# EAGLE schematic BBiQ-Teensy (EAGLE 9.1.0)
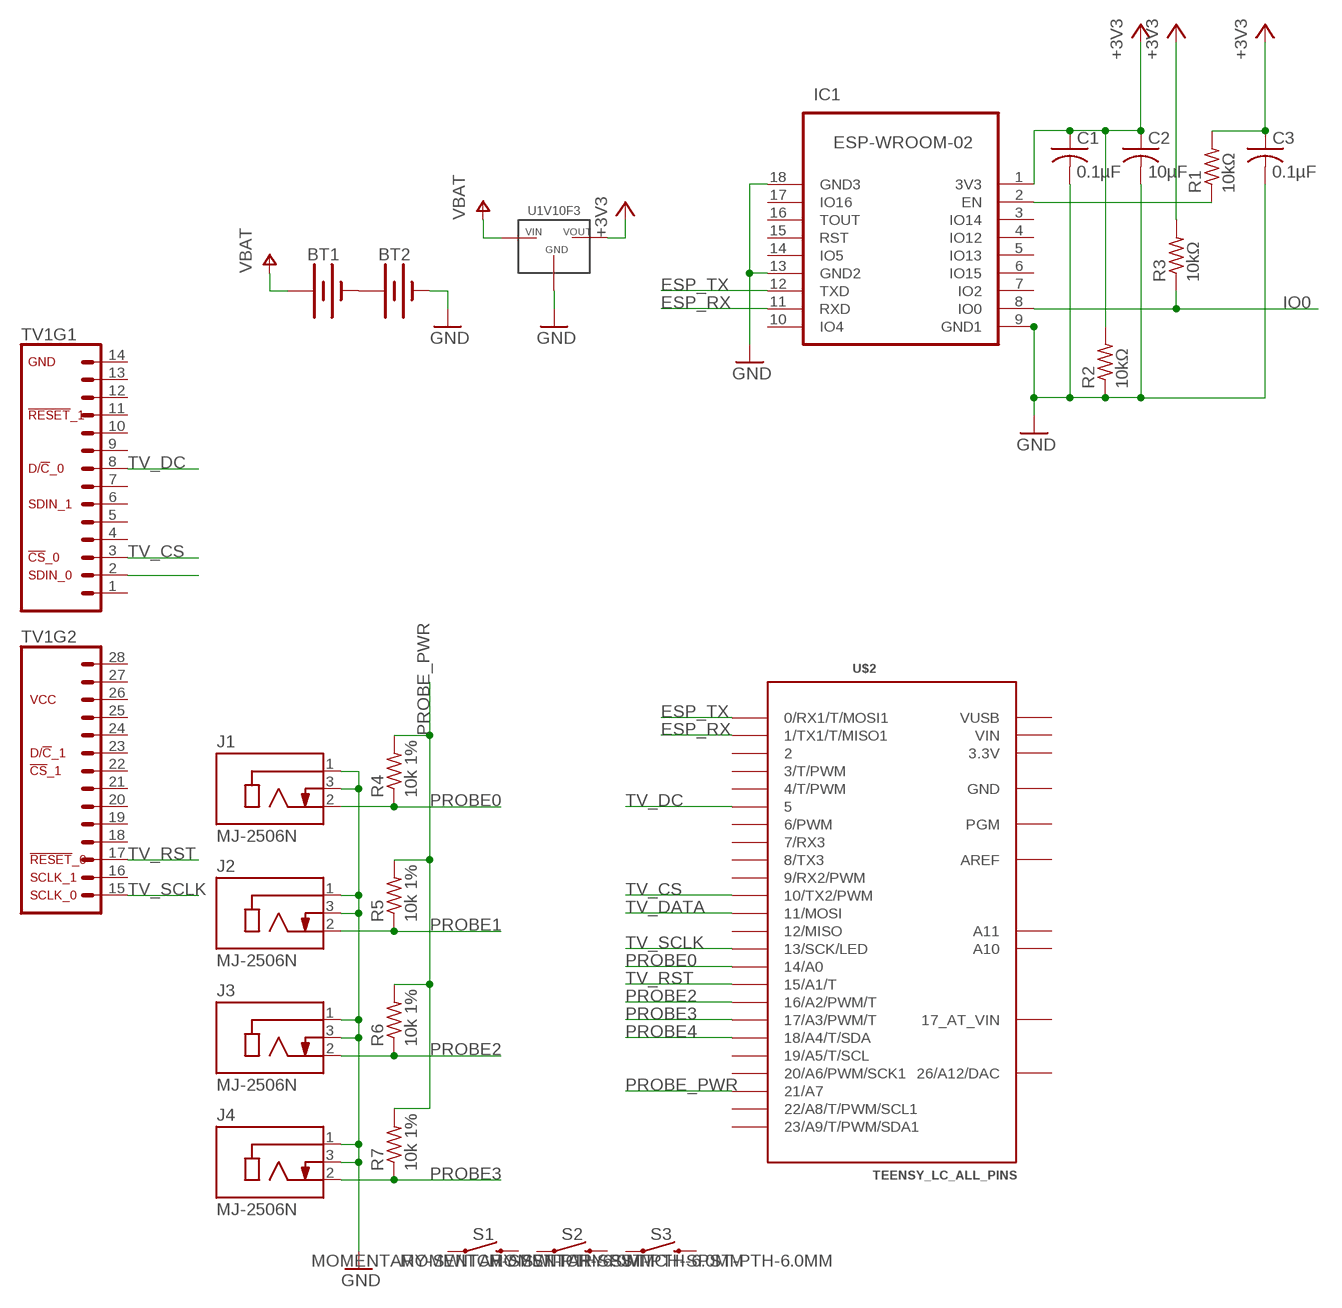
[diagram p0: schematic, sheet 1]

## Parts
BT1  BATTERY-AA  [BATTERY-AA]
BT2  BATTERY-AA  [BATTERY-AA]
C1  0.1µF  C-US025-025X050  [C025-025X050]
C2  10µF  C-US025-025X050  [C025-025X050]
C3  0.1µF  C-US025-025X050  [C025-025X050]
IC1  ESP-WROOM-02  [ESP-WROOM-02]
J1  MJ-2506N  [CUI_MJ-2506N]
J2  MJ-2506N  [CUI_MJ-2506N]
J3  MJ-2506N  [CUI_MJ-2506N]
J4  MJ-2506N  [CUI_MJ-2506N]
R1  10kΩ  R-US_0204/5  [0204/5]
R2  10kΩ  R-US_0204/5  [0204/5]
R3  10kΩ  R-US_0204/5  [0204/5]
R4  10k 1%  R-US_0204/5  [0204/5]
R5  10k 1%  R-US_0204/5  [0204/5]
R6  10k 1%  R-US_0204/5  [0204/5]
R7  10k 1%  R-US_0204/5  [0204/5]
S1  MOMENTARY-SWITCH-SPST-PTH-6.0MM  [TACTILE_SWITCH_PTH_6.0MM]
S2  MOMENTARY-SWITCH-SPST-PTH-6.0MM  [TACTILE_SWITCH_PTH_6.0MM]
S3  MOMENTARY-SWITCH-SPST-PTH-6.0MM  [TACTILE_SWITCH_PTH_6.0MM]
TV1  TEENSYVIEW  [TEENSYVIEW]
U$1  U1V10F3  [U1V10F3]
U$2  TEENSY_LC_ALL_PINS  [TEENSY_3.0-3.2&LC_ALL_PINS]

## Nets
+3V3: C1.1 C2.1 C3.1 IC1.1(3V3) R1.2 R2.2 R3.2 U$1.VOUT
ESP_RX: IC1.11(RXD) U$2.1(1/TX1/T/MISO1)
ESP_TX: IC1.12(TXD) U$2.0(0/RX1/T/MOSI1)
GND: BT2.GND@1(-) C1.2 C2.2 C3.2 IC1.9(GND1) IC1.13(GND2) IC1.18(GND3) IC1.19(GND0) J1.1 J1.3 J2.1 J2.3 J3.1 J3.3 J4.1 J4.3 R2.1 U$1.GND
IO0: IC1.8(IO0) R3.1
N$1: BT1.GND@1(-) BT2.PWR@1(+)
N$3: IC1.2(EN) R1.1
PROBE0: J1.2 R4.1 U$2.14/A0
PROBE1: J2.2 R5.1
PROBE2: J3.2 R6.1 U$2.16/A2(16/A2/PWM/T)
PROBE3: J4.2 R7.1 U$2.17/A3(17/A3/PWM/T)
PROBE4: U$2.18/A4(18/A4/T/SDA)
PROBE_PWR: R4.2 R5.2 R6.2 R7.2 U$2.21/A7
TV_CS: TV1.3 U$2.10(10/TX2/PWM)
TV_DATA: TV1.2 U$2.11(11/MOSI)
TV_DC: TV1.8 U$2.5
TV_RST: TV1.17 U$2.15/A1(15/A1/T)
TV_SCLK: TV1.15 U$2.13(13/SCK/LED)
V+: BT1.PWR@1(+) U$1.VIN ; supply symbol labelled VBAT
Unconnected: IC1.3(IO14) IC1.4(IO12) IC1.5(IO13) IC1.6(IO15) IC1.7(IO2) IC1.10(IO4) IC1.14(IO5) IC1.15(RST) IC1.16(TOUT) IC1.17(IO16) S1.1 S1.3 S2.1 S2.3 S3.1 S3.3 TV1.1 TV1.4 TV1.5 TV1.6 TV1.7 TV1.9 TV1.10 TV1.11 TV1.12 TV1.13 TV1.14 TV1.16 TV1.18 TV1.19 TV1.20 TV1.21 TV1.22 TV1.23 TV1.24 TV1.25 TV1.26 TV1.27 TV1.28 U$2.2 U$2.3(3/T/PWM) U$2.4(4/T/PWM) U$2.6(6/PWM) U$2.7(7/RX3) U$2.8(8/TX3) U$2.9(9/RX2/PWM) U$2.12(12/MISO) U$2.19/A5(19/A5/T/SCL) U$2.20/A6(20/A6/PWM/SCK1) U$2.22/A8(22/A8/T/PWM/SCL1) U$2.23/A9(23/A9/T/PWM/SDA1) U$2.A10 U$2.A11 U$2.PGM U$2.VBAT(17_AT_VIN)

## Power pins joined to a net without a drawn wire
26/A12/DAC: U$2.RESET/DAC(26/A12/DAC)
+3V3: U$2.3.3V U$2.3.3V1(3.3V)
AREF: U$2.AREF
GND: U$2.AGND(GND) U$2.GND U$2.GND1(GND)
VIN: U$2.VIN
VUSB: U$2.VUSB

## Library data of the parts
BT1 BT2 = SparkFun-Batteries:BATTERY: Battery - Single Cell A variety of battery chemistries, sizes, and footprints. Device List: 20MM_PTH - Coin Cell Battery Holder - 20mm (PTH) <https://www.sparkfun.com/products/783> 6.8MM_PTH - Coin Cell Battery Holder - 6.8MM(SMD) <https://www.digikey.com/product-detail/en/seiko-instruments/MS621FE-FL11E/728-1057-ND/1889208?WT.srch=1&gclid=CNOQ5a6LzdQCFZS2wAodXCkE0g> 12MM_SMD - Coin Cell Battery Holder - 12mm (SMD) <https://www.sparkfun.com/products/10592> 12MM_PTH - Coin Cell Battery Holder - 12mm (PTH) <https://www.sparkfun.com/products/7948> 20MM_SMD - 20mm Coin Cell Battery Holder (SMD) (2 legs) Used on the Big Time Watch Kit <https://www.sparkfun.com/products/11734> 20MM_SMD_4LEGS - Coin Cell Battery Holder - 20mm (SMD) <https://www.sparkfun.com/products/11892> 20MM_SMD_4LEGS_OVERPASTE - Coin Cell Battery Holder - 20mm (SMD) <https://www.sparkfun.com/products/11892> (Over-paste on the legs) 24.5MM_PTH - Coin Cell Battery Holder - 24.5mm (PTH) <https://www.sparkfun.com/products/8863> 9V - 9V Battery Holder - PC Mount Used on the SparkFun SparkPunk Sound Kit <https://www.sparkfun.com/products/11177> and SparkFun SparkPunk Sequencer Kit <https://www.sparkfun.com/products/12707> 18650 - Battery Holder - 18650 (PTH) <https://www.sparkfun.com/products/13113> AA - Battery Holder - 1xAA (PTH) <https://www.sparkfun.com/products/7949> AAA - Battery Holder - 1xAAA (PTH) <https://www.sparkfun.com/products/12718> AA_KIT - Battery Holder - 1xAA (PTH) <https://www.sparkfun.com/products/7949> Special kit package - pads only have exposed copper on one side of the board. AAA_KIT - Battery Holder - 1xAAA (PTH) <https://www.sparkfun.com/products/12718> Special kit package - pads only have exposed copper on one side of the board.; PROD_ID: BATT-08316; SF_SKU: PRT-07949
C1-C3 = resistor:C-US: CAPACITOR, American symbol
IC1 = esp-wroom-02:ESP-WROOM-02: WiFi module - ESP-WROOM-02
J1-J4 = MJ-2506N:MJ-2506N: 2.5 mm, Mono, Right Angle, Through Hole, Audio Jack Connector; MANUFACTURER: CUI INC; PART_REV: E; STANDARD: MANUFACTURER RECOMMENDATIONS
R1-R7 = resistor:R-US_: RESISTOR, American symbol
S1-S3 = SparkFun-Switches:MOMENTARY-SWITCH-SPST: Momentary Switch (Pushbutton) - SPST Normally-open (NO) SPST momentary switches (buttons, pushbuttons). Variants PTH-12MM - 12mm square, through-hole Momentary Pushbutton Switch - 12mm Square <https://www.sparkfun.com/products/9190> (COM-09190) PTH-6.0MM, PTH-6.0MM-KIT - 6.0mm square, through-hole Mini Pushbutton Switch <https://www.sparkfun.com/products/97> (COM-00097) KIT package intended for soldering kit's - only one side of pads' copper is exposed. PTH-RIGHT-ANGLE-KIT - Right-angle, through-hole Right Angle Tactile Button <https://www.sparkfun.com/products/10791> - Used on SparkFun BigTime Watch Kit <https://www.sparkfun.com/products/11734> SMD-12MM - 12mm square, surface-mount Tactile Button - SMD (12mm) <https://www.sparkfun.com/products/12993> (COM-12993) Used on SparkFun PicoBoard <https://www.sparkfun.com/products/11888> SMD-4.5MM - 4.5mm Square Trackball Switch Used on SparkFun Blackberry Trackballer Breakout <https://www.sparkfun.com/products/13169> SMD-4.6MMX2.8MM - 4.60mm x 2.80mm, surface mount Used on SparkFun SAMD21 Mini Breakout <https://www.sparkfun.com/products/13664> SMD-5.2MM, SMD-5.2-REDUNDANT - 5.2mm square, surface-mount Mini Pushbutton Switch - SMD <https://www.sparkfun.com/products/8720> (COM-08720) Used on Arduino Pro Mini <https://www.sparkfun.com/products/11114> REDUNDANT package connects both switch circuits together SMD-6.0X3.5MM - 6.0 x 3.5mm, surface mount Momentary Reset Switch SMD <https://www.sparkfun.com/products/8229> (COM-08229) SMD-6.2MM-TALL - 6.2mm square, surface mount Tactile Button - SMD (6mm) <https://www.sparkfun.com/products/12992> Used on SparkFun Digital Sandbox <https://www.sparkfun.com/products/12651> SMD-RIGHT-ANGLE - Right-angle, surface mount Used on SparkFun Block for Intel® Edison - Arduino <https://www.sparkfun.com/products/13036>; PROD_ID: SWCH-08441; SF_SKU: COM-00097
TV1 = SparkFun-Boards:TEENSYVIEW
U$1 = U1V10F3:U1V10F3: U1V10F3 3.3 Volt Spannungsregler-Board Pololu
U$2 = Teensy_3_and_LC_Series_Boards_v1.4:TEENSY_LC_ALL_PINS: Teensy LC board with all pins used.